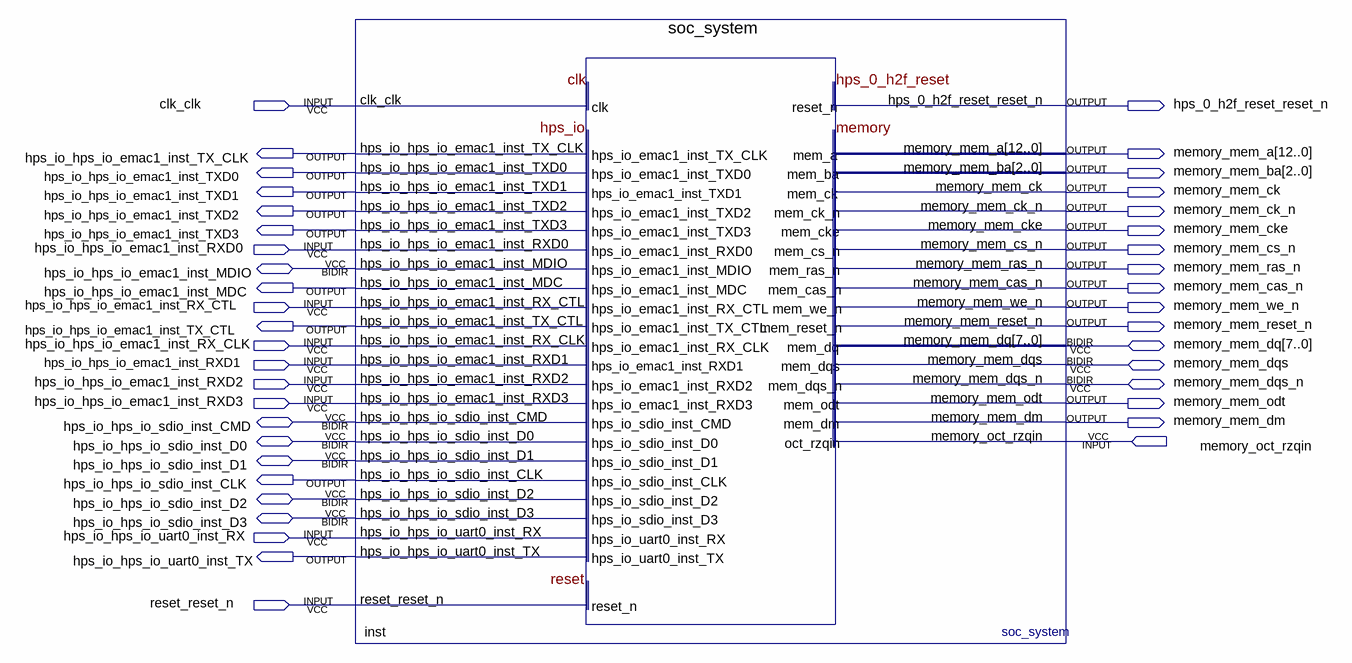
[diagram p0: schematic sheet]
// Quartus schematic main.bdf as structural Verilog: 1 symbols, 41 pins
module main (
  input  clk_clk,
  input  hps_io_hps_io_emac1_inst_RXD0,
  input  hps_io_hps_io_emac1_inst_RX_CTL,
  input  hps_io_hps_io_emac1_inst_RX_CLK,
  input  hps_io_hps_io_emac1_inst_RXD1,
  input  hps_io_hps_io_emac1_inst_RXD2,
  input  hps_io_hps_io_emac1_inst_RXD3,
  input  memory_oct_rzqin,
  input  hps_io_hps_io_uart0_inst_RX,
  input  reset_reset_n,
  inout  hps_io_hps_io_emac1_inst_MDIO,
  inout  [7:0] memory_mem_dq,
  inout  memory_mem_dqs,
  inout  memory_mem_dqs_n,
  inout  hps_io_hps_io_sdio_inst_CMD,
  inout  hps_io_hps_io_sdio_inst_D0,
  inout  hps_io_hps_io_sdio_inst_D1,
  inout  hps_io_hps_io_sdio_inst_D2,
  inout  hps_io_hps_io_sdio_inst_D3,
  output hps_0_h2f_reset_reset_n,
  output hps_io_hps_io_emac1_inst_TX_CLK,
  output [12:0] memory_mem_a,
  output hps_io_hps_io_emac1_inst_TXD0,
  output [2:0] memory_mem_ba,
  output hps_io_hps_io_emac1_inst_TXD1,
  output memory_mem_ck,
  output hps_io_hps_io_emac1_inst_TXD2,
  output memory_mem_ck_n,
  output hps_io_hps_io_emac1_inst_TXD3,
  output memory_mem_cke,
  output memory_mem_cs_n,
  output memory_mem_ras_n,
  output hps_io_hps_io_emac1_inst_MDC,
  output memory_mem_cas_n,
  output memory_mem_we_n,
  output hps_io_hps_io_emac1_inst_TX_CTL,
  output memory_mem_reset_n,
  output memory_mem_odt,
  output memory_mem_dm,
  output hps_io_hps_io_sdio_inst_CLK,
  output hps_io_hps_io_uart0_inst_TX
);

  soc_system inst (
    .clk_clk(clk_clk), .hps_io_hps_io_emac1_inst_RXD0(hps_io_hps_io_emac1_inst_RXD0),
    .hps_io_hps_io_emac1_inst_RX_CTL(hps_io_hps_io_emac1_inst_RX_CTL),
    .hps_io_hps_io_emac1_inst_RX_CLK(hps_io_hps_io_emac1_inst_RX_CLK),
    .hps_io_hps_io_emac1_inst_RXD1(hps_io_hps_io_emac1_inst_RXD1),
    .hps_io_hps_io_emac1_inst_RXD2(hps_io_hps_io_emac1_inst_RXD2),
    .hps_io_hps_io_emac1_inst_RXD3(hps_io_hps_io_emac1_inst_RXD3),
    .hps_io_hps_io_uart0_inst_RX(hps_io_hps_io_uart0_inst_RX), .memory_oct_rzqin(memory_oct_rzqin),
    .reset_reset_n(reset_reset_n), .hps_0_h2f_reset_reset_n(hps_0_h2f_reset_reset_n),
    .hps_io_hps_io_emac1_inst_TX_CLK(hps_io_hps_io_emac1_inst_TX_CLK),
    .hps_io_hps_io_emac1_inst_TXD0(hps_io_hps_io_emac1_inst_TXD0),
    .hps_io_hps_io_emac1_inst_TXD1(hps_io_hps_io_emac1_inst_TXD1),
    .hps_io_hps_io_emac1_inst_TXD2(hps_io_hps_io_emac1_inst_TXD2),
    .hps_io_hps_io_emac1_inst_TXD3(hps_io_hps_io_emac1_inst_TXD3),
    .hps_io_hps_io_emac1_inst_MDC(hps_io_hps_io_emac1_inst_MDC),
    .hps_io_hps_io_emac1_inst_TX_CTL(hps_io_hps_io_emac1_inst_TX_CTL),
    .hps_io_hps_io_sdio_inst_CLK(hps_io_hps_io_sdio_inst_CLK),
    .hps_io_hps_io_uart0_inst_TX(hps_io_hps_io_uart0_inst_TX), .memory_mem_a(memory_mem_a),
    .memory_mem_ba(memory_mem_ba), .memory_mem_ck(memory_mem_ck), .memory_mem_ck_n(memory_mem_ck_n),
    .memory_mem_cke(memory_mem_cke), .memory_mem_cs_n(memory_mem_cs_n), .memory_mem_ras_n(memory_mem_ras_n),
    .memory_mem_cas_n(memory_mem_cas_n), .memory_mem_we_n(memory_mem_we_n),
    .memory_mem_reset_n(memory_mem_reset_n), .memory_mem_odt(memory_mem_odt), .memory_mem_dm(memory_mem_dm),
    .hps_io_hps_io_emac1_inst_MDIO(hps_io_hps_io_emac1_inst_MDIO),
    .hps_io_hps_io_sdio_inst_CMD(hps_io_hps_io_sdio_inst_CMD),
    .hps_io_hps_io_sdio_inst_D0(hps_io_hps_io_sdio_inst_D0),
    .hps_io_hps_io_sdio_inst_D1(hps_io_hps_io_sdio_inst_D1),
    .hps_io_hps_io_sdio_inst_D2(hps_io_hps_io_sdio_inst_D2),
    .hps_io_hps_io_sdio_inst_D3(hps_io_hps_io_sdio_inst_D3), .memory_mem_dq(memory_mem_dq),
    .memory_mem_dqs(memory_mem_dqs), .memory_mem_dqs_n(memory_mem_dqs_n));
endmodule
